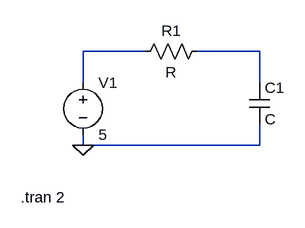
[diagram p0: schematic Draft1.asc]
Draft1.asc, the LTspice schematic file:
Version 4
SHEET 1 880 680
WIRE 176 64 80 64
WIRE 352 64 256 64
WIRE 80 112 80 64
WIRE 352 112 352 64
WIRE 80 208 80 192
WIRE 352 208 352 176
WIRE 352 208 80 208
FLAG 80 208 0
SYMBOL voltage 80 96 R0
WINDOW 123 0 0 Left 0
WINDOW 39 0 0 Left 0
SYMATTR InstName V1
SYMATTR Value 5
SYMBOL res 272 48 R90
WINDOW 0 0 56 VBottom 2
WINDOW 3 32 56 VTop 2
SYMATTR InstName R1
SYMBOL cap 336 112 R0
SYMATTR InstName C1
TEXT -16 288 Left 2 !.tran 2

The netlist it stands for:
* Draft1.asc
V1 N001 0 5
R1 N002 N001 R
C1 N002 0 C
.tran 2
.backanno
.end